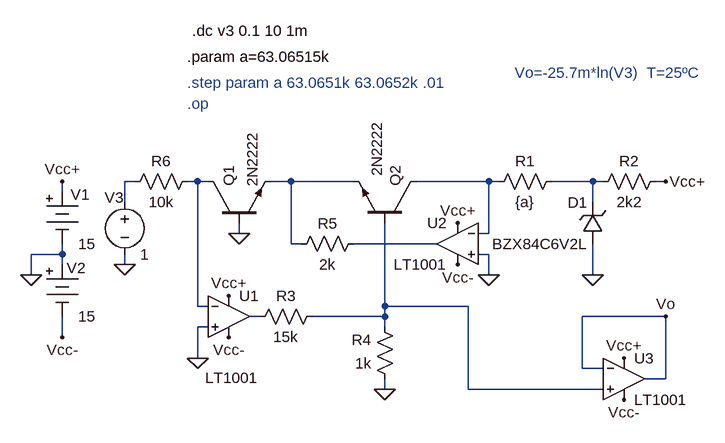
[diagram p0: schematic log2.asc]
log2.asc, the LTspice schematic file:
Version 4
SHEET 1 1432 680
WIRE -912 -272 -928 -272
WIRE -816 -272 -832 -272
WIRE -800 -272 -816 -272
WIRE -672 -272 -704 -272
WIRE -576 -272 -672 -272
WIRE -368 -272 -480 -272
WIRE -352 -272 -368 -272
WIRE -208 -272 -272 -272
WIRE -192 -272 -208 -272
WIRE -96 -272 -112 -272
WIRE -1024 -256 -1024 -272
WIRE -928 -240 -928 -272
WIRE -208 -240 -208 -272
WIRE -752 -192 -752 -208
WIRE -368 -192 -368 -272
WIRE -368 -192 -384 -192
WIRE -672 -176 -672 -272
WIRE -656 -176 -672 -176
WIRE -448 -176 -576 -176
WIRE -1024 -160 -1024 -176
WIRE -1024 -160 -1072 -160
WIRE -368 -160 -384 -160
WIRE -1024 -144 -1024 -160
WIRE -928 -144 -928 -160
WIRE -1072 -128 -1072 -160
WIRE -368 -128 -368 -160
WIRE -208 -128 -208 -176
WIRE -816 -80 -816 -272
WIRE -800 -80 -816 -80
WIRE -528 -80 -528 -208
WIRE -400 -80 -528 -80
WIRE -720 -64 -736 -64
WIRE -528 -64 -528 -80
WIRE -528 -64 -640 -64
WIRE -96 -64 -224 -64
WIRE -800 -48 -816 -48
WIRE -528 -48 -528 -64
WIRE -1024 -32 -1024 -64
WIRE -816 0 -816 -48
WIRE -224 16 -224 -64
WIRE -192 16 -224 16
WIRE -96 32 -96 -64
WIRE -96 32 -128 32
WIRE -528 48 -528 32
WIRE -400 48 -400 -80
WIRE -192 48 -400 48
FLAG -1072 -128 0
FLAG -1024 -272 Vcc+
FLAG -1024 -32 Vcc-
FLAG -768 -96 Vcc+
FLAG -416 -208 Vcc+
FLAG -768 -32 Vcc-
FLAG -416 -144 Vcc-
FLAG -752 -192 0
FLAG -96 -272 Vcc+
FLAG -208 -128 0
FLAG -368 -128 0
FLAG -528 48 0
FLAG -816 0 0
FLAG -928 -144 0
FLAG -160 0 Vcc+
FLAG -160 64 Vcc-
FLAG -96 -64 Vo
SYMBOL Misc\\battery -1024 -272 R0
WINDOW 123 0 0 Left 0
WINDOW 39 0 0 Left 0
WINDOW 0 13 20 Left 2
SYMATTR InstName V1
SYMATTR Value 15
SYMBOL Misc\\battery -1024 -160 R0
WINDOW 123 0 0 Left 0
WINDOW 39 0 0 Left 0
WINDOW 0 7 21 Left 2
SYMATTR InstName V2
SYMATTR Value 15
SYMBOL OpAmps\\LT1001 -768 -128 R0
WINDOW 3 -36 158 Left 2
SYMATTR InstName U1
SYMBOL OpAmps\\LT1001 -416 -240 M0
SYMATTR InstName U2
SYMBOL npn -800 -208 R270
SYMATTR InstName Q1
SYMATTR Value 2N2222
SYMBOL npn -480 -208 M270
WINDOW 3 72 60 Left 2
SYMATTR InstName Q2
SYMATTR Value 2N2222
SYMBOL res -256 -288 R90
WINDOW 0 0 56 VBottom 2
WINDOW 3 32 56 VTop 2
SYMATTR InstName R1
SYMATTR Value {a}
SYMBOL res -96 -288 R90
WINDOW 0 0 56 VBottom 2
WINDOW 3 32 56 VTop 2
SYMATTR InstName R2
SYMATTR Value 2k2
SYMBOL zener -192 -176 R180
WINDOW 0 24 64 Left 2
WINDOW 3 24 0 Left 2
SYMATTR InstName D1
SYMATTR Value BZX84C6V2L
SYMBOL res -624 -80 R90
WINDOW 0 0 56 VBottom 2
WINDOW 3 32 56 VTop 2
SYMATTR InstName R3
SYMATTR Value 15k
SYMBOL res -512 48 R180
WINDOW 0 36 76 Left 2
WINDOW 3 36 40 Left 2
SYMATTR InstName R4
SYMATTR Value 1k
SYMBOL res -560 -192 R90
WINDOW 0 0 56 VBottom 2
WINDOW 3 32 56 VTop 2
SYMATTR InstName R5
SYMATTR Value 2k
SYMBOL res -816 -288 R90
WINDOW 0 0 56 VBottom 2
WINDOW 3 32 56 VTop 2
SYMATTR InstName R6
SYMATTR Value 10k
SYMBOL voltage -928 -256 R0
WINDOW 123 0 0 Left 0
WINDOW 39 0 0 Left 0
WINDOW 0 -31 9 Left 2
SYMATTR InstName V3
SYMATTR Value 1
SYMBOL OpAmps\\LT1001 -160 -32 R0
SYMATTR InstName U3
TEXT -832 -392 Left 2 ;.op
TEXT -832 -424 Left 2 ;.step param a 63.0651k 63.0652k .01
TEXT -832 -464 Left 2 !.param a=63.06515k
TEXT -824 -504 Left 2 !.dc v3 0.1 10 1m
TEXT -328 -440 Left 2 ;Vo=-25.7m*ln(V3)  T=25ºC

The netlist it stands for:
* log2.asc
V1 Vcc+ 0 15
V2 0 Vcc- 15
XU1 0 N002 Vcc+ Vcc- N008 LT1001  ; pins In+ In- V+ V- OUT
XU2 0 N004 Vcc+ Vcc- N006 LT1001  ; pins In+ In- V+ V- OUT
Q1 N002 0 N003 0 2N2222
Q2 N004 N007 N003 0 2N2222
R1 N005 N004 {a}
R2 Vcc+ N005 2k2
D1 0 N005 BZX84C6V2L
R3 N007 N008 15k
R4 0 N007 1k
R5 N006 N003 2k
R6 N002 N001 10k
V3 N001 0 1
XU3 N007 Vo Vcc+ Vcc- Vo LT1001  ; pins In+ In- V+ V- OUT
.model D D
.lib standard.dio
.model NPN NPN
.model PNP PNP
.lib standard.bjt
* .op
* .step param a 63.0651k 63.0652k .01
.param a=63.06515k
.dc v3 0.1 10 1m
* Vo=-25.7m*ln(V3)  T=25ºC
.lib LTC.lib
.backanno
.end